# EAGLE schematic esp-batterynode-01 (EAGLE 7.3.0)
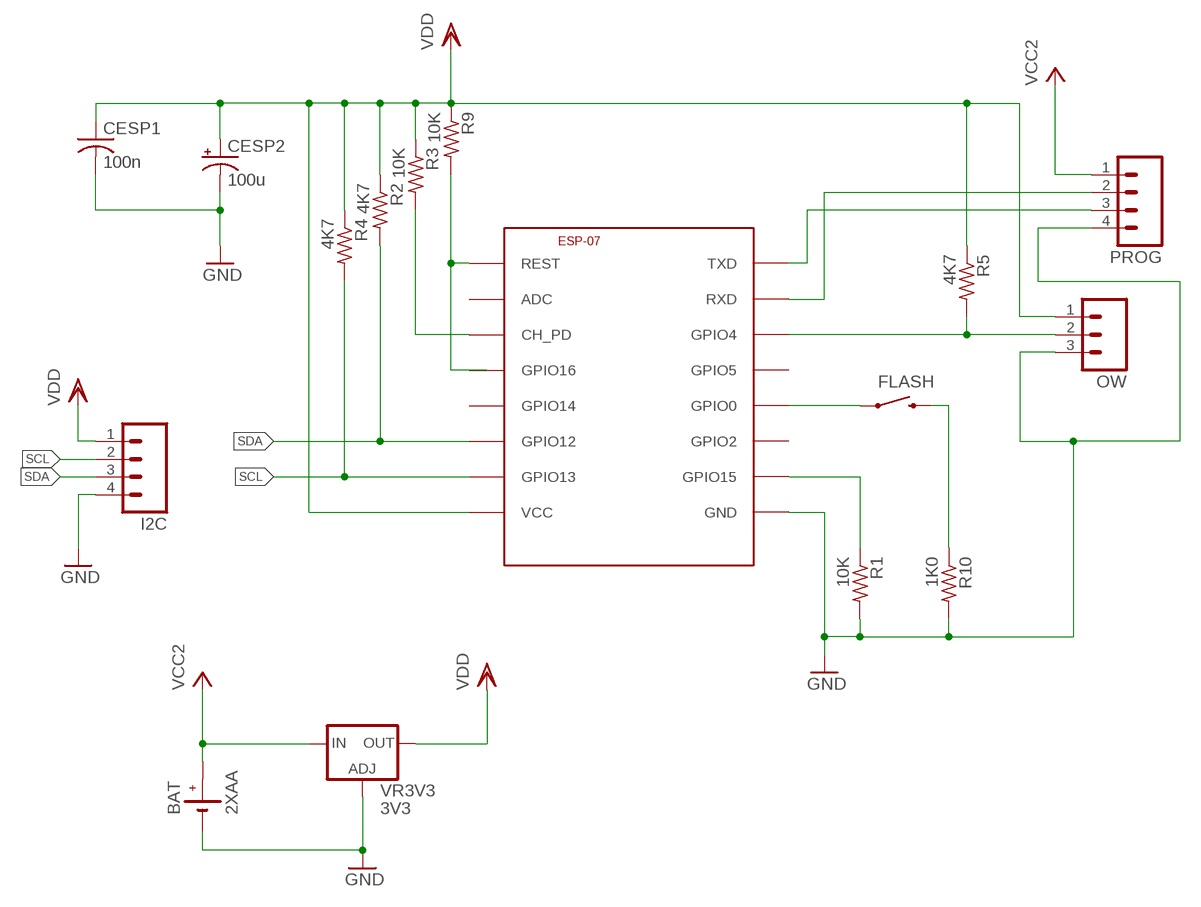
[diagram p0: schematic, sheet 1]

## Parts
BAT  2XAA  [KEYSTONE-2XAA]
CESP1  100n  C-USC0603  [C0603]
CESP2  100u  CPOL-USE2.5-5  [E2,5-5]
ESP-07  ESP8266-07  [ESP-07]
FLASH  SWITCH-MOMENTARY-2  [TACTILE_SWITCH_TALL]
I2C  M04LOCK_LONGPADS  [1X04_LOCK_LONGPADS]
OW  M03LOCK_LONGPADS  [1X03_LOCK_LONGPADS]
PROG  M04LOCK  [1X04_LOCK]
R1  10K  R-US_R0603  [R0603]
R2  4K7  R-US_R0603  [R0603]
R3  10K  R-US_R0603  [R0603]
R4  4K7  R-US_R0603  [R0603]
R5  4K7  R-US_R0603  [R0603]
R9  10K  R-US_R0603  [R0603]
R10  1K0  R-US_R0603  [R0603]
VR3V3  3V3  LM317TS  [317TS]

## Nets
ESPRX: ESP-07.RXD PROG.2
ESPTX: ESP-07.TXD PROG.3
GND: BAT.NEG(-) CESP1.2 CESP2.- ESP-07.GND I2C.4 OW.3 PROG.4 R1.2 R10.2 VR3V3.1(ADJ)
GPIO0: ESP-07.GPIO0 FLASH.A2
N$6: ESP-07.CH_PD R3.2
N$13: ESP-07.GPIO15 R1.1
OW: ESP-07.GPIO4 OW.2 R5.2
PRG: FLASH.B2 R10.1
REST: ESP-07.REST R9.2
SCL: ESP-07.GPIO13 I2C.2 R4.2
SDA: ESP-07.GPIO12 I2C.3 R2.2
VCC: BAT.POS(+) PROG.1 VR3V3.3(IN) ; supply symbol labelled VCC2
VDD: CESP1.1 CESP2.+ ESP-07.VCC I2C.1 OW.1 R2.1 R3.1 R4.1 R5.1 R9.1 VR3V3.2(OUT)
Unconnected: ESP-07.ADC ESP-07.GPIO2 ESP-07.GPIO5 ESP-07.GPIO14 ESP-07.GPIO16

## Library data of the parts
BAT = battery-holders:2XAA
CESP1 = rcl:C-US: CAPACITOR, American symbol
CESP2 = rcl:CPOL-US: POLARIZED CAPACITOR, American symbol
ESP-07 = lio:ESP8266
FLASH = SparkFun:SWITCH-MOMENTARY-2
I2C PROG = SparkFun:M04: Header 4 Standard 4-pin 0.1" header. Use with straight break away headers (SKU : PRT-00116), right angle break away headers (PRT-00553), swiss pins (PRT-00743), machine pins (PRT-00117), and female headers (PRT-00115). Molex polarized connector foot print use with SKU : PRT-08231 with associated crimp pins and housings. 1MM SMD Version SKU: PRT-10208
OW = SparkFun:M03: Header 3 Standard 3-pin 0.1" header. Use with straight break away headers (SKU : PRT-00116), right angle break away headers (PRT-00553), swiss pins (PRT-00743), machine pins (PRT-00117), and female headers (PRT-00115). Molex polarized connector foot print use with SKU : PRT-08232 with associated crimp pins and housings.
R1-R5 R9 R10 = rcl:R-US_: RESISTOR, American symbol
VR3V3 = v-reg:LM317TS: VOLTAGE REGULATOR